# EAGLE schematic Tilt-PIC12F635 (EAGLE 6.4)
Circuito per prelevare gli impulsi provenienti da un tilt e creare impulsi di lunghezza determinata
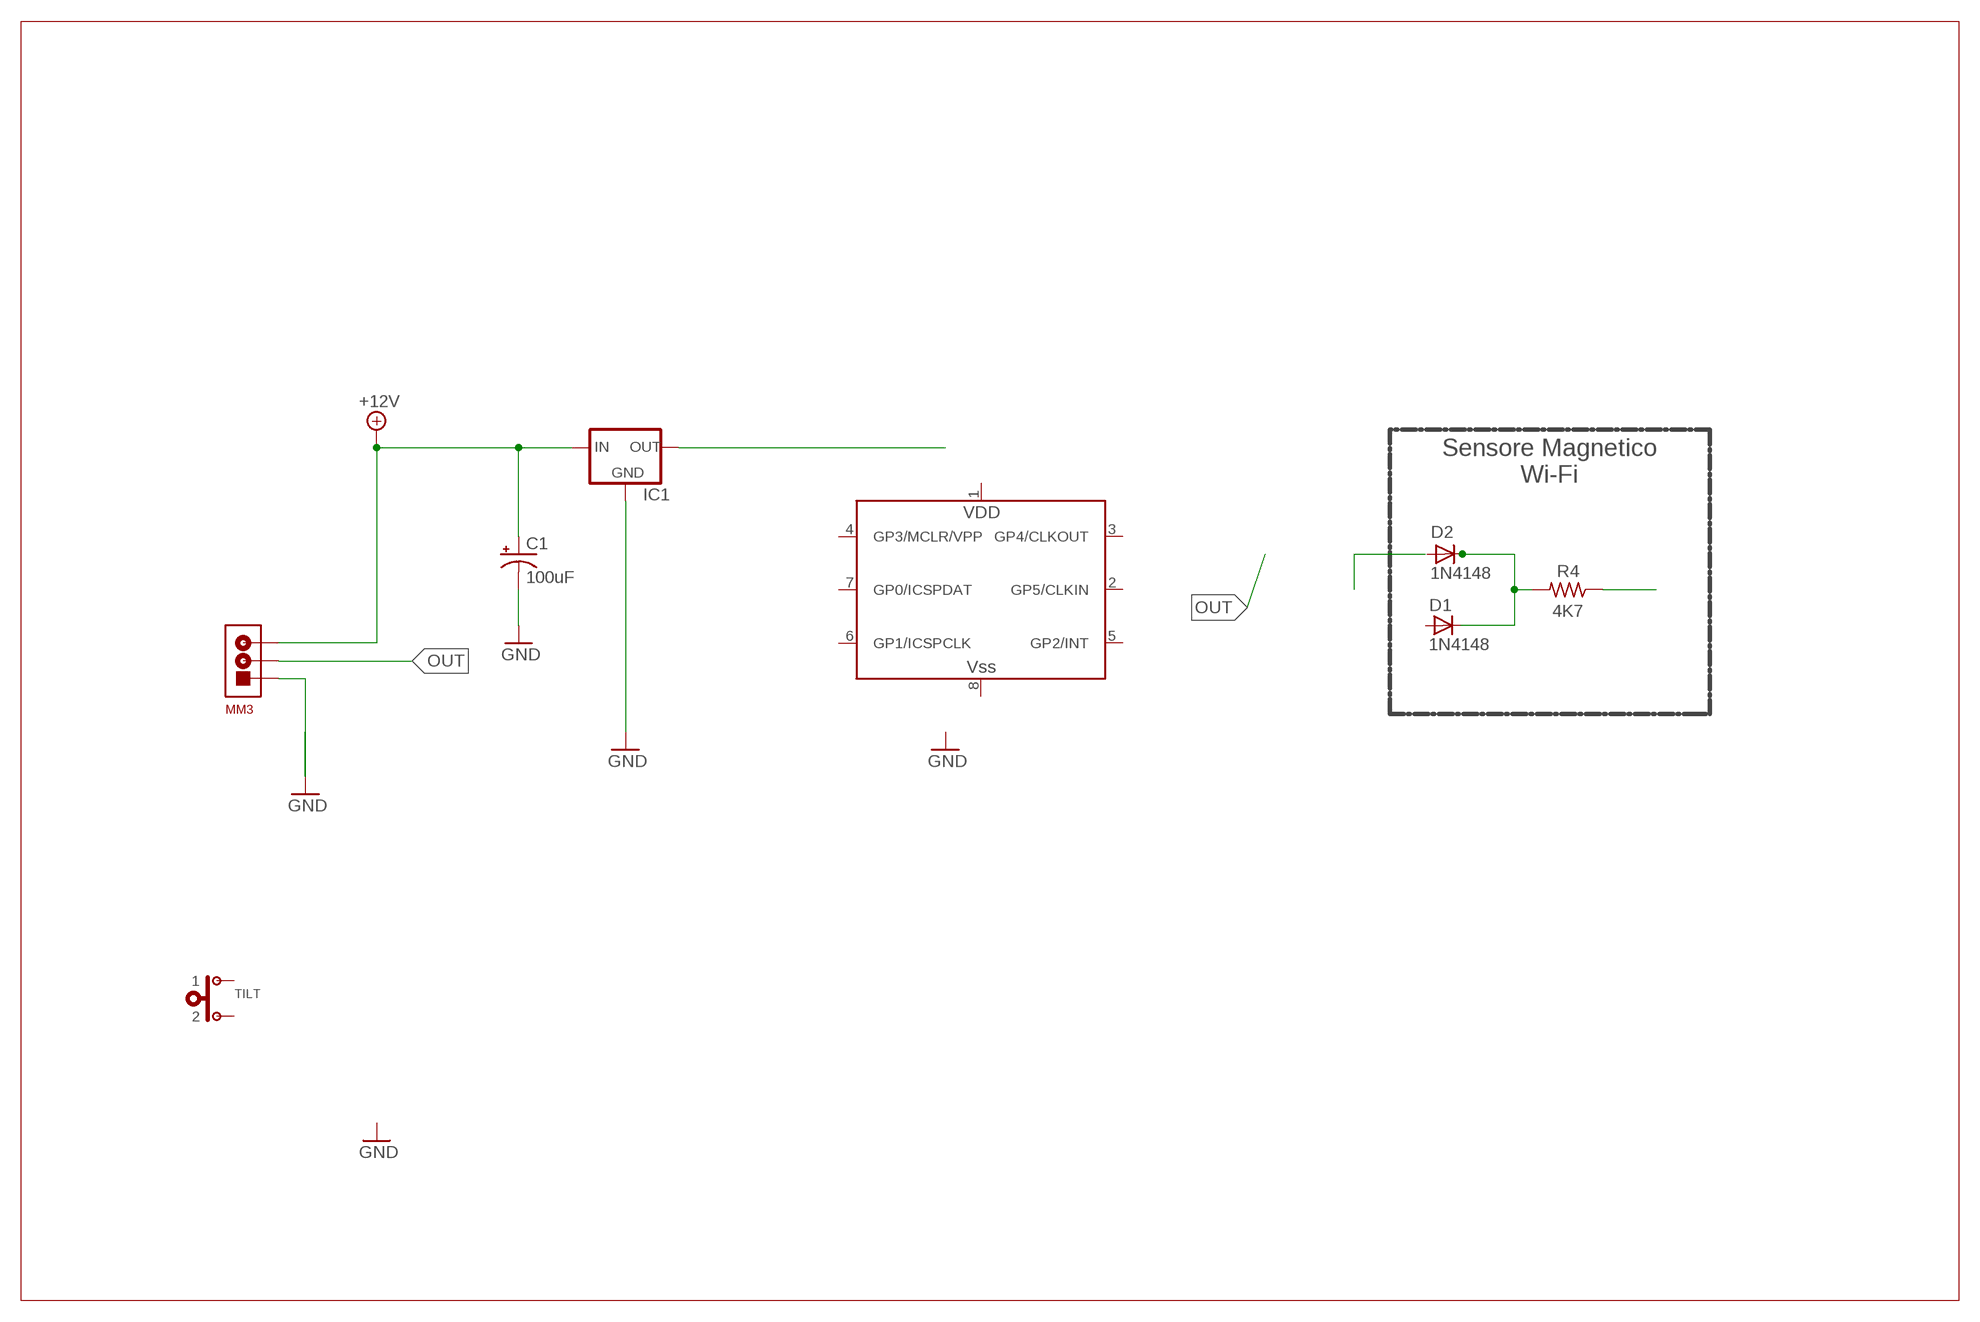
[diagram p0: schematic, sheet 1]

## Parts
C1  100uF  CPOL-US085CS-1AR  [085CS_1AR]
D1  1N4148  1N4148DO35-10  [DO35-10]
D2  1N4148  1N4148DO35-10  [DO35-10]
IC1  78LXX  [78LXX]
MM3  MAMMUTH03  [MAMMUTH03]
R4  4K7  R-US_0207/12  [0207/12]
TILT  PULSANTENO  [SIP02]
U$1  PIC12F635  [DIL8]

## Nets
+12V: C1.+ IC1.IN MM3.P$3
GND: C1.- IC1.GND MM3.P$1
N$1: IC1.OUT
N$6: D1.C D2.C R4.2
OUT: MM3.P$2
SENSORE: R4.1
Unconnected: D1.A D2.A TILT.1 TILT.2 U$1.2(GP5/CLKIN) U$1.3(GP4/CLKOUT) U$1.4(GP3/MCLR/VPP) U$1.5(GP2/INT) U$1.6(GP1/ICSPCLK) U$1.7(GP0/ICSPDAT)

## Notes on the sheet
- Sensore Magnetico
  Wi-Fi

## Power pins joined to a net without a drawn wire
VDD: U$1.1(VDD)
VSS: U$1.8(VSS)

## Library data of the parts
C1 = Ln-RCL:CPOL-US: POLARIZED CAPACITOR, American symbol
D1 D2 = diode:1N4148: DIODE high speed (Philips)
IC1 = Ln-v-reg:78LXX: VOLTAGE REGULATOR
MM3 = Ln-Varie:MAMMUTH03: Mammuth 03
R4 = rcl:R-US_: RESISTOR, American symbol
TILT = Ln-Varie:PULSANTENO: Pulsante NO
U$1 = LN-microchip:PIC12F635